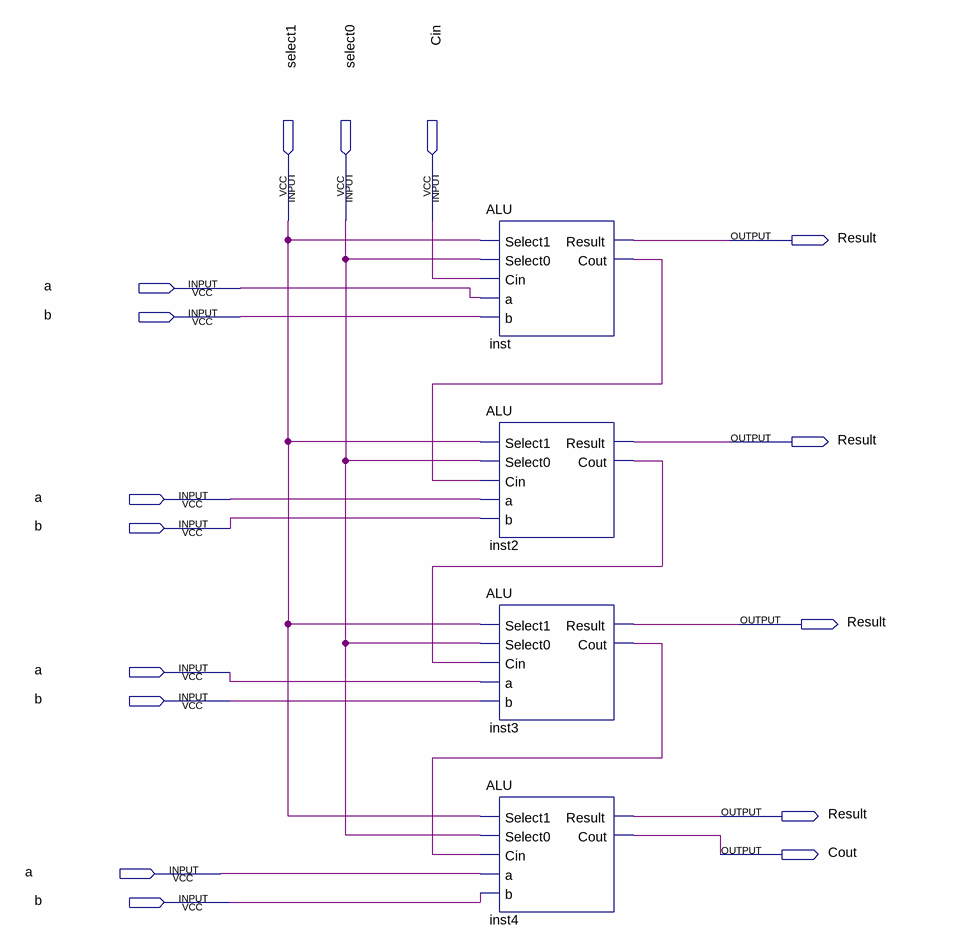
[diagram p0: schematic sheet]
// Quartus schematic 4BitALU.bdf as structural Verilog: 4 symbols, 16 pins
module \4BitALU  (
  input  select1,
  input  select0,
  input  Cin,
  input  a,
  input  b,
  output Result,
  output Cout
);

  wire inst2_cout, inst3_cout, inst_cout;

  ALU inst (.Select1(select1), .Select0(select0), .Cin(Cin), .a(a), .b(b), .Result(Result), .Cout(inst_cout));
  ALU inst2 (.Select1(select1), .Select0(select0), .Cin(inst_cout), .a(a), .b(b), .Result(Result), .Cout(inst2_cout));
  ALU inst3 (.Select1(select1), .Select0(select0), .Cin(inst2_cout), .a(a), .b(b), .Result(Result), .Cout(inst3_cout));
  ALU inst4 (.Select1(select1), .Select0(select0), .Cin(inst3_cout), .a(a), .b(b), .Result(Result), .Cout(Cout));
endmodule
